# Altium project AquaSOS DevBoard.PrjPcb
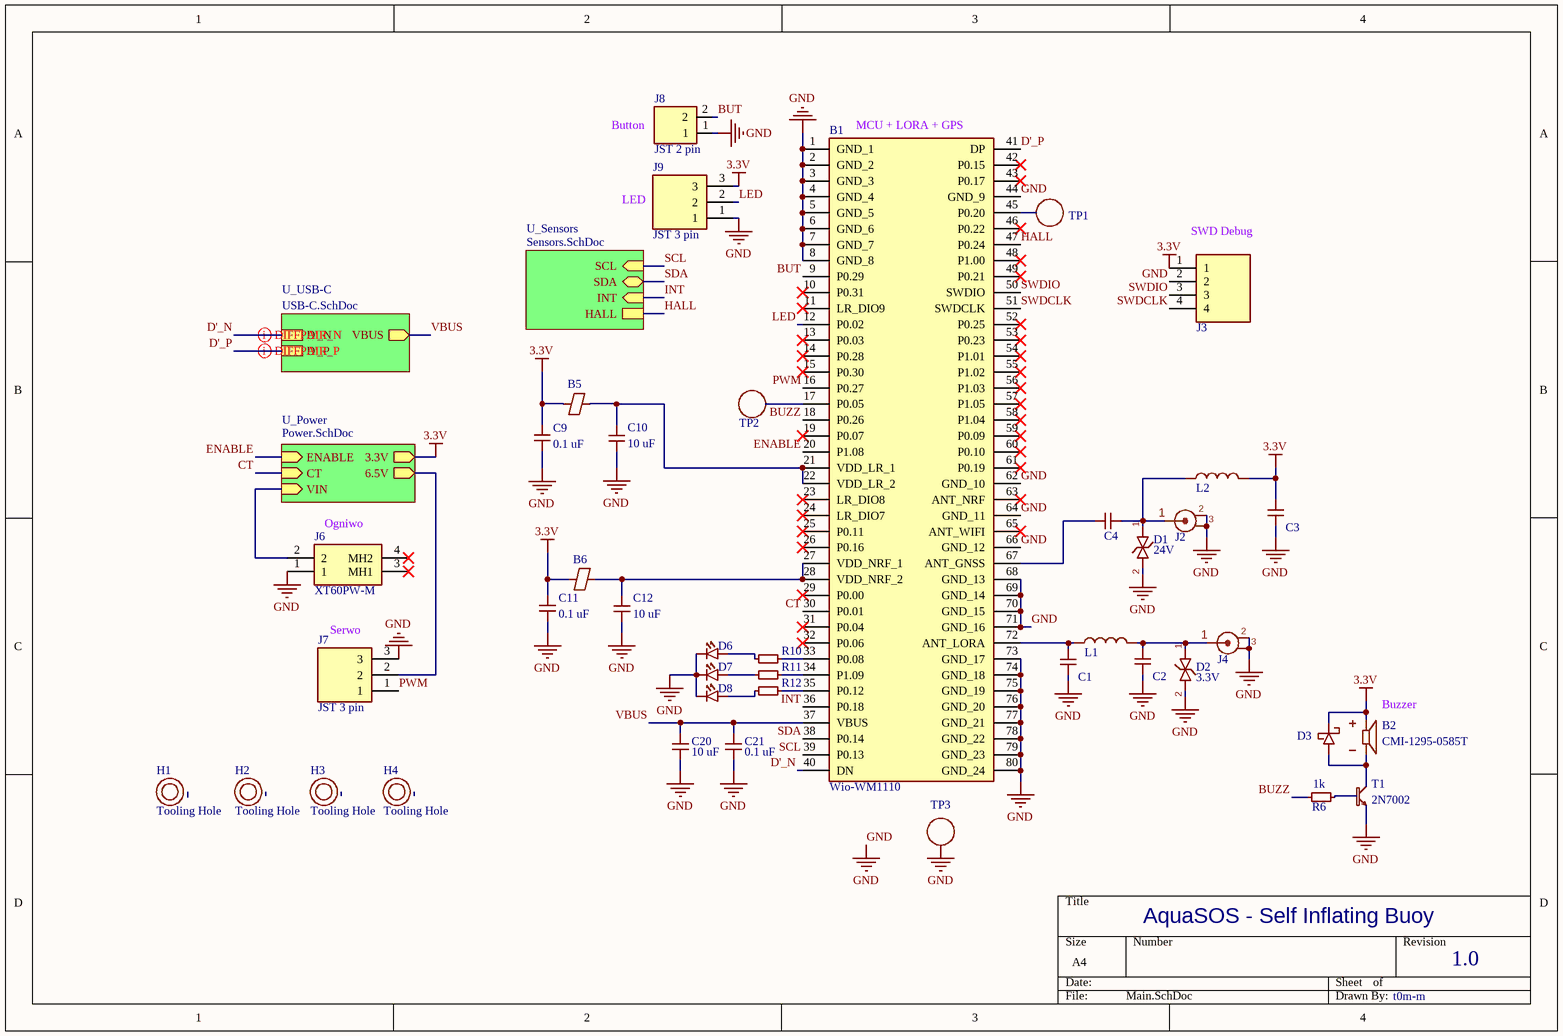
[diagram p0: Main.SchDoc]
4 sheets, 71 parts. Net scope: hierarchical (ports join the sheet entries above them; power ports are global).
Board file: PCB1.PcbDoc
Sheets:
  Main.SchDoc
    U_Sensors = Sensors.SchDoc
    U_USB-C = USB-C.SchDoc
    U_Power = Power.SchDoc

## Sheet Main.SchDoc
size A4; SheetNumber: 1; SheetTotal: 4

### Parts
B1  Wio-WM1110  [WioWM1110]
B2  CMI-1295-0585T  [CMI-1295-0585T]
B5  MPZ1608S121ATDH5  [MPZ1608S121ATDH5]  (value not drawn)
B6  MPZ1608S121ATDH5  [MPZ1608S121ATDH5]  (value not drawn)
C1  Capacitor  [KGM05CS60J106MH]  (value not drawn)
C2  Capacitor  [KGM05CS60J106MH]  (value not drawn)
C3  Capacitor  [KGM05CS60J106MH]  (value not drawn)
C4  Capacitor  [KGM05CS60J106MH]  (value not drawn)
C9  0.1 uF  [MLASU105SB7104KFNB25]
C10  10 uF  [KGM05CS60J106MH]
C11  0.1 uF  [MLASU105SB7104KFNB25]
C12  10 uF  [KGM05CS60J106MH]
C20  10 uF  [KGM05CS60J106MH]
C21  0.1 uF  [MLASU105SB7104KFNB25]
D1  24V  [RCLAMP2431TTCT]
D2  CPDV3V3A-HF  [CPDV3V3A-HF]  (value not drawn)
D3  BAT5402VH6327XTSA1  [BAT5402VH6327XTSA1]  (value not drawn)
D6  APT1608SGC  [APT1608SGC]  (value not drawn)
D7  APT1608SGC  [APT1608SGC]  (value not drawn)
D8  APT1608SGC  [APT1608SGC]  (value not drawn)
H1  Tooling Hole  [Tooling Hole]  (no BOM)
H2  Tooling Hole  [Tooling Hole]  (no BOM)
H3  Tooling Hole  [Tooling Hole]  (no BOM)
H4  Tooling Hole  [Tooling Hole]  (no BOM)
J2  U.FL-R-SMT-1(10)  [HRS_U.FL-R-SMT-1(10)]  (value not drawn)
J3  22-10-2041  [1x4 Goldpin Header]  (value not drawn)
J4  U.FL-R-SMT-1(10)  [HRS_U.FL-R-SMT-1(10)]  (value not drawn)
J6  XT60PW-M  [XT60PWM]
J7  JST 3 pin  [S3B-PH-K-S]
J8  JST 2 pin  [JST_S2B-PH-K-S(LF)(SN)]
J9  JST 3 pin  [S3B-PH-K-S]
L1  Inductor  [KGM05CS60J106MH]  (value not drawn)
L2  Inductor  [KGM05CS60J106MH]  (value not drawn)
R6  MR04X102 JTL  [MR04X102 JTL]  (value not drawn)
R10  300  [RC0402JR-075K1P]  (value not drawn)
R11  300  [RC0402JR-075K1P]  (value not drawn)
R12  300  [RC0402JR-075K1P]  (value not drawn)
T1  2N7002  [2N7002]
TP1  TP  [Test Point]  (value not drawn)  (no BOM)
TP2  TP  [Test Point]  (value not drawn)  (no BOM)
TP3  TP  [Test Point]  (value not drawn)  (no BOM)

### Sub-sheets
U_Power = Power.SchDoc: ENABLE (in), 6.5V (out), VIN (in), CT (in), 3.3V (out)
U_Sensors = Sensors.SchDoc: SCL (in), SDA (bidir), INT (in), HALL
U_USB-C = USB-C.SchDoc: VBUS (out), D'_N, D'_P

### Nets
3.3V: B2.P B5.1 B6.1 C3.1 C9.1 C11.1 D3.2(A) J3.1 J9.3 L2.2 ; sheet U_Power/3.3V
GND: B1.1(GND_1) B1.2(GND_2) B1.3(GND_3) B1.4(GND_4) B1.5(GND_5) B1.6(GND_6) B1.7(GND_7) B1.8(GND_8) B1.44(GND_9) B1.62(GND_10) B1.64(GND_11) B1.66(GND_12) B1.68(GND_13) B1.69(GND_14) B1.70(GND_15) B1.71(GND_16) B1.73(GND_17) B1.74(GND_18) B1.75(GND_19) B1.76(GND_20) B1.77(GND_21) B1.78(GND_22) B1.79(GND_23) B1.80(GND_24) C1.2 C2.2 C3.2 C9.2 C10.2 C11.2 C12.2 C20.2 C21.2 D1.2(A) D2.2(A) D6.1(K) D7.1(K) D8.1(K) J2.2 J2.3 J3.2 J4.2 J4.3 J6.1 J7.3 J8.1 J9.1 T1.2(S) TP3.1
6.5V: J7.2 ; sheet U_Power/6.5V
BUT: B1.9(P0.29) J8.2
BUZZ: B1.18(P0.26) R6.1
CT: B1.30(P0.01) ; sheet U_Power/CT
D'_N: B1.40(DN) ; sheet U_USB-C/D'_N
D'_P: B1.41(DP) ; sheet U_USB-C/D'_P
ENABLE: B1.20(P1.08) ; sheet U_Power/ENABLE
HALL: B1.47(P0.24) ; sheet U_Sensors/HALL
INT: B1.36(P0.18) ; sheet U_Sensors/INT
LED: B1.12(P0.02) J9.2
PWM: B1.16(P0.27) J7.1
SCL: B1.39(P0.13) ; sheet U_Sensors/SCL
SDA: B1.38(P0.14) ; sheet U_Sensors/SDA
SWDCLK: B1.51(SWDCLK) J3.4
SWDIO: B1.50(SWDIO) J3.3
VBUS: B1.37(VBUS) C20.1 C21.1 ; sheet U_USB-C/VBUS
VIN: J6.2 ; sheet U_Power/VIN
NetB1_17: B1.17(P0.05) TP2.1
NetB1_21: B1.21(VDD_LR_1) B1.22(VDD_LR_2) B5.2 C10.1
NetB1_27: B1.27(VDD_NRF_1) B1.28(VDD_NRF_2) B6.2 C12.1
NetB1_33: B1.33(P0.08) R10.2
NetB1_34: B1.34(P1.09) R11.2
NetB1_35: B1.35(P0.12) R12.2
NetB1_45: B1.45(P0.20) TP1.1
NetB1_67: B1.67(ANT_GNSS) C4.1
NetB1_72: B1.72(ANT_LORA) C1.1 L1.1
NetB2_N: B2.N D3.1(K) T1.3(D)
NetC2_1: C2.1 D2.1(K) J4.1 L1.2
NetC4_2: C4.2 D1.1(K) J2.1 L2.1
NetD6_2: D6.2(A) R10.1
NetD7_2: D7.2(A) R11.1
NetD8_2: D8.2(A) R12.1
NetR6_2: R6.2 T1.1(G)

Not connected (* = marked no-connect by the designer): B1 10(P0.31)* 11(LR_DIO9)* 13(P0.03)* 14(P0.28)* 15(P0.30)* 19(P0.07)* 23(LR_DIO8)* 24(LR_DIO7)* 25(P0.11)* 26(P0.16)* 29(P0.00)* 31(P0.04)* 32(P0.06)* 42(P0.15)* 43(P0.17)* 46(P0.22)* 48(P1.00)* 49(P0.21)* 52(P0.25)* 53(P0.23)* 54(P1.01)* 55(P1.02)* 56(P1.03)* 57(P1.05)* 58(P1.04)* 59(P0.09)* 60(P0.10)* 61(P0.19)* 63(ANT_NRF)* 65(ANT_WIFI)*; J6 3(MH1)* 4(MH2)*

### Layout directives
differential pair: D'_N, D'_P

### Notes on the sheet
- (near J8) Button
- (near B1) MCU + LORA + GPS
- LED
- (near J3) SWD Debug
- (near J6) Ogniwo
- (near J7) Serwo
- (near D2) 3.3V
- (near B2) Buzzer
- (near R6) 1k
- AquaSOS - Self Inflating Buoy
- 1.0
- t0m-m

### Library data of the parts
B1 = Wio-WM1110: LoRa Wireless Module - Powered by Semtech; Manufacturer_Name: Seeed Studio; Geometry.Height: 2.3mm; Manufacturer_Part_Number: Wio-WM1110; Mouser Part Number: *; Mouser Price/Stock: *; Arrow Part Number: *; Arrow Price/Stock: *; Datasheet Link: https://files.seeedstudio.com/products/SenseCAP/Wio-WM1110/Wio-WM1110_Module_Datasheet_V1.3.pdf; ComponentLink1Description: Shop link; ComponentLink1URL: https://botland.com.pl/lokalizatory-gps-gsm-bluetooth/23517-wio-wm1110-uklad-loragpswifibluetooth-semtech-lr1110-nordic-nrf52840-seeedstudio-114992865.html
B2 = CMI-1295-0585T: Buzzer
B5 B6 = MPZ1608S121ATDH5: Ferrite Beads 0603 120ohms 2000mA Power Line AEC-Q200; Manufacturer_Name: TDK; Geometry.Height: 0.75mm; Mouser Part Number: 810-MPZ1608S121ATDH5; Mouser Price/Stock: https://www.mouser.co.uk/ProductDetail/TDK/MPZ1608S121ATDH5?qs=pvNC7ksEVIcGR4VJPzSI2g%3D%3D; Manufacturer_Part_Number: MPZ1608S121ATDH5; Datasheet Link: https://product.tdk.com/system/files/dam/doc/product/emc/emc/beads/catalog/beads_automotive_power_mpz1608_en.pdf
C1-C4 = Capacitor: 0402 SMD
C9 C11 C21 = MLASU105SB7104KFNB25: 0.1uF Capacitor
C10 C12 C20 = KGM05CS60J106MH: 10 uF Capacitor
D1 = RCLAMP2431T.TCT: ESD Suppressors / TVS Diodes LOW CAP/ESD CLAP, 1 LINE; Manufacturer_Name: SEMTECH; Geometry.Height: 0.43mm; Mouser Part Number: 947-RCLAMP2431T.TCT; Mouser Price/Stock: https://www.mouser.co.uk/ProductDetail/Semtech/RCLAMP2431T.TCT?qs=rBWM4%252BvDhIfEdbY6IS5fCw%3D%3D; Manufacturer_Part_Number: RCLAMP2431T.TCT; Datasheet Link: https://semtech.my.salesforce.com/sfc/p/#E0000000JelG/a/44000000MChm/nAD_16Ash9zTcNc8tEIG0CGjjA0gXByRbqZlpqVEQMY
D2 = CPDV3V3A-HF: 3.3 V, 0.4pF, Bidirectional
D3 = BAT5402VH6327XTSA1: Schottky Diode
D6-D8 = APT1608SGC: 0402 SMD LED
J2 J4 = U.FL-R-SMT-1(10): Antenna Connector
J3 = 1x4 Goldpin Header: Headers & Wire Housings VERT PCB HDR 4P GOLD PLATING; Manufacturer_Name: Molex; Geometry.Height: 11.17mm; Mouser Part Number: 538-22-10-2041; Mouser Price/Stock: https://www.mouser.co.uk/ProductDetail/Molex/22-10-2041?qs=I2tGkhXPHwPlInpHG6ZNmQ%3D%3D; Manufacturer_Part_Number: 22-10-2041; Datasheet Link: https://www.molex.com/en-us/products/part-detail/22102041?display=pdf
J6 = XT60PW-M: Connector: DC supply; socket; XT60; male; PIN: 2; on PCBs; THT; 30A; Manufacturer_Name: Amass; Geometry.Height: 8.4mm; TME Electronic Components Part Number: *; TME Electronic Components Price/Stock: *; Manufacturer_Part_Number: XT60PW-M; Datasheet Link: https://www.tme.eu/Document/b13629717d44ae038681dba08d18c0b6/XT60PW-M.pdf
J7 J9 = JST 3 pin: JST 3 pin connector
J8 = JST 2 pin: Connector Header Through Hole, Right Angle 2 position; MF: JST Sales America Inc.; MP: S2B-PH-K-S(LF)(SN); SnapEDA_Link: https://www.snapeda.com/parts/S2B-PH-K-S(LF)(SN)/JST/view-part/?ref=snap; Package: NON STANDARD-2 J.S.T.; Value: *; Check_prices: https://www.snapeda.com/parts/S2B-PH-K-S(LF)(SN)/JST/view-part/?ref=eda
R6 = MR04X102 JTL: 1k 0402 Resistor
R10-R12 = CR0402-FX-3000GLF
T1 = 2N7002: Transistor
TP1-TP3 = Test Point

## Sheet Sensors.SchDoc
size A4; SheetNumber: 2; SheetTotal: 4
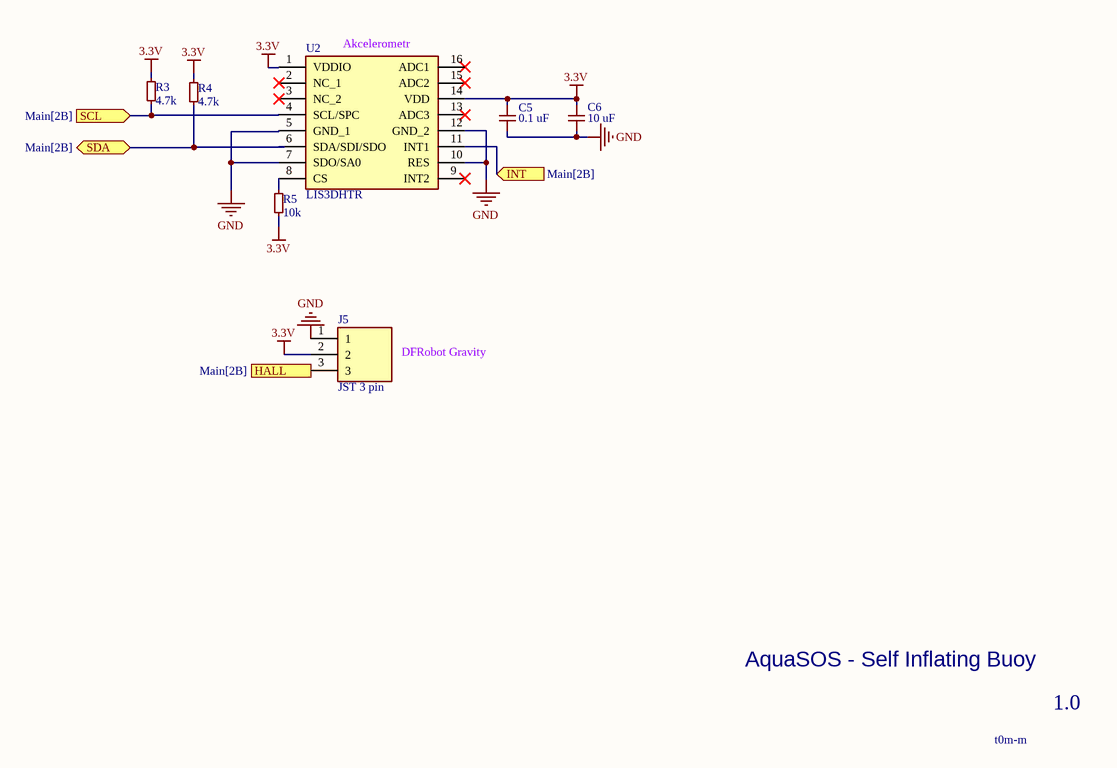
[diagram p1: Sensors.SchDoc]

### Parts
C5  0.1 uF  [MLASU105SB7104KFNB25]
C6  10 uF  [KGM05CS60J106MH]
J5  JST 3 pin  [S3B-PH-K-S]
R3  4.7k  [CRCW040210K0FKEDC]
R4  4.7k  [CRCW040210K0FKEDC]
R5  10k  [CRCW040210K0FKEDC]
U2  LIS3DHTR  [LIS3DHTR]

### Ports
HALL (see Main[2B]), INT (in, see Main[2B]), SCL (in, see Main[2B]), SDA (bidir, see Main[2B])

### Nets
3.3V: C5.1 C6.1 J5.2 R3.1 R4.2 R5.2 U2.1(VDDIO) U2.14(VDD)
GND: C5.2 C6.2 J5.1 U2.5(GND_1) U2.7(SDO/SA0) U2.10(RES) U2.12(GND_2)
HALL: J5.3 ; port HALL
INT: U2.11(INT1) ; port INT
SCL: R3.2 U2.4(SCL/SPC) ; port SCL
SDA: R4.1 U2.6(SDA/SDI/SDO) ; port SDA
NetR5_1: R5.1 U2.8(CS)

Not connected (* = marked no-connect by the designer): U2 2(NC_1)* 3(NC_2)* 9(INT2)* 13(ADC3)* 15(ADC2)* 16(ADC1)*

### Notes on the sheet
- (near U2) Akcelerometr
- DFRobot Gravity
- AquaSOS - Self Inflating Buoy
- 1.0
- t0m-m

### Library data of the parts
C5 = MLASU105SB7104KFNB25: 0.1uF Capacitor
C6 = KGM05CS60J106MH: 10 uF Capacitor
J5 = JST 3 pin: JST 3 pin connector
R3 R4 = RC0402FR-7D4K7L: 4.7k 0402 resistor
R5 = CRCW040210K0FKEDC: 10k 0402 Resistor
U2 = LIS3DHTR: Accelerometer 3-Axis 2g/16g 1.8V LGA16 STMicroelectronics LIS3DHTR Accelerometer IC, 3-axis, I2C, SPI 1.71  3.6 V, 16-Pin LGA; Geometry.Height: 1mm; Mouser Part Number: 511-LIS3DHTR; Mouser Price/Stock: https://www.mouser.co.uk/ProductDetail/STMicroelectronics/LIS3DHTR?qs=6la6oa3D8xzhXYax3cEo4w%3D%3D; Manufacturer_Name: STMicroelectronics; Manufacturer_Part_Number: LIS3DHTR; Datasheet Link: https://www.st.com/resource/en/datasheet/lis3dh.pdf

## Sheet USB-C.SchDoc
size A4; SheetNumber: 3; SheetTotal: 4
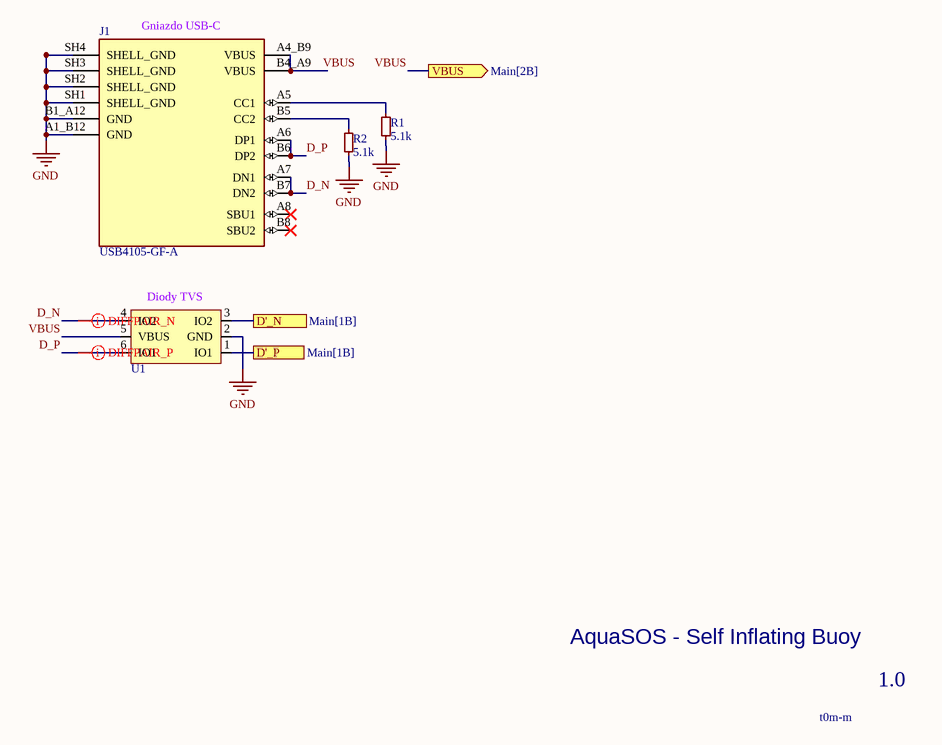
[diagram p2: USB-C.SchDoc]

### Parts
J1  USB4105-GF-A  [GCT_USB4105-GF-A]
R1  5.1k  [RC0402JR-075K1P]
R2  5.1k  [RC0402JR-075K1P]
U1  USBLC6-2SC6  [USBLC6-2SC6]  (value not drawn)

### Ports
D'_N (see Main[1B]), D'_P (see Main[1B]), VBUS (out, see Main[2B])

### Nets
GND: J1.A1_B12(GND) J1.B1_A12(GND) J1.SH1(SHELL_GND) J1.SH2(SHELL_GND) J1.SH3(SHELL_GND) J1.SH4(SHELL_GND) R1.2 R2.2 U1.2(GND)
D'_N: U1.3(IO2) ; port D'_N
D'_P: U1.1(IO1) ; port D'_P
D_N: J1.A7(DN1) J1.B7(DN2) U1.4(IO2)
D_P: J1.A6(DP1) J1.B6(DP2) U1.6(IO1)
VBUS: J1.A4_B9(VBUS) J1.B4_A9(VBUS) U1.5(VBUS) ; port VBUS
NetJ1_A5: J1.A5(CC1) R1.1
NetJ1_B5: J1.B5(CC2) R2.1

Not connected (* = marked no-connect by the designer): J1 A8(SBU1)* B8(SBU2)*

### Layout directives
differential pair: D_N, D_P

### Notes on the sheet
- (near J1) Gniazdo USB-C
- (near U1) Diody TVS
- AquaSOS - Self Inflating Buoy
- 1.0
- t0m-m

### Library data of the parts
J1 = USB4105-GF-A: USB-C Connector, USB 2.0; MF: {'manufacturer': u'GCT'}; Package: None; Price: None; Value: *; MP: USB4105-GF-A; Availability: Unavailable
R1 R2 = RC0402JR-075K1P: 5.1k resistor; ComponentLink1Description: Mouser link; ComponentLink1URL: https://www.mouser.pl/ProductDetail/YAGEO/RC0402JR-075K1P?qs=qpJ%252B%252B%252Bdg6p1LG47uFSJoBw%3D%3D
U1 = USBLC6-2SC6: ESD/TVS Diodes; ComponentLink1Description: Mouser Link; ComponentLink1URL: https://www.mouser.pl/ProductDetail/STMicroelectronics/USBLC6-2SC6?qs=po45yt2pPpu%2FhNIlwQdTlg%3D%3D&utm_id=9882661914&utm_source=google&utm_medium=cpc&utm_marketing_tactic=emeacorp&gad_source=1&gad_campaignid=9882661914&gbraid=0AAAAADn_wf3e2b9L6UzwCvd5llWdJDX32&gclid=CjwKCAiAtLvMBhB_EiwA1u6_PphI6vqALNJyH9qzLX2TgkqKXihyqulPr-2MUC0dCpD_RqMgLp4OABoC-lQQAvD_BwE

## Sheet Power.SchDoc
size A4; SheetNumber: 4; SheetTotal: 4
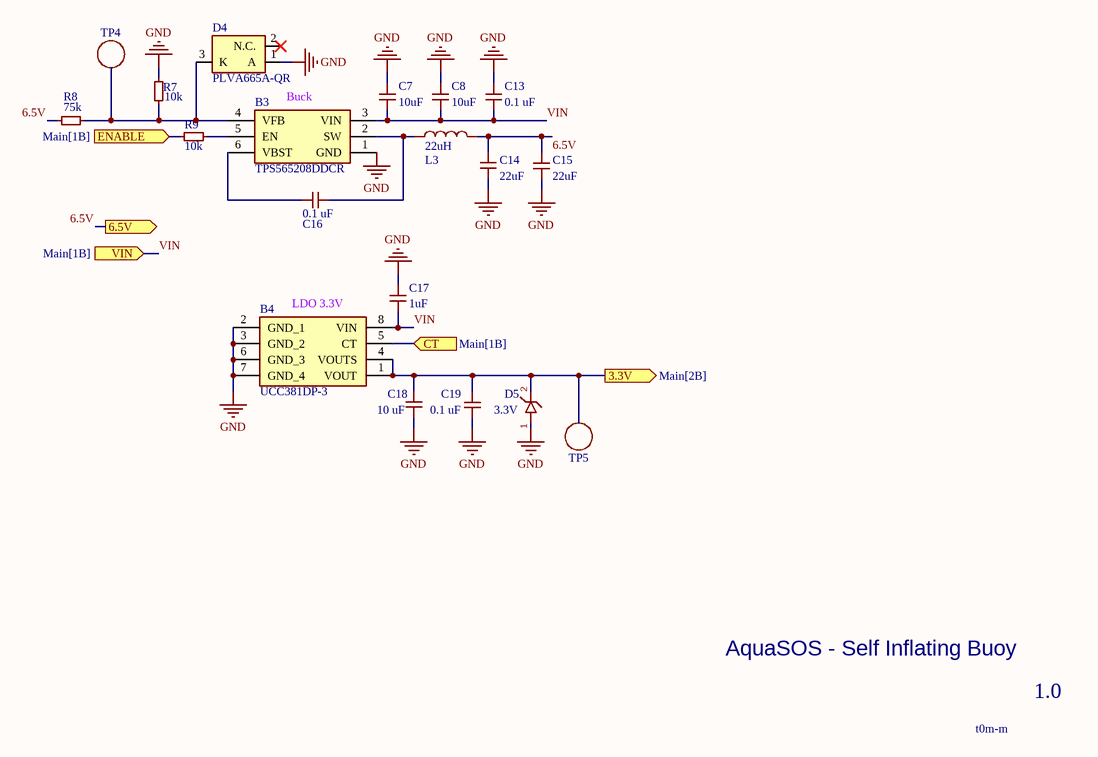
[diagram p3: Power.SchDoc]

### Parts
B3  TPS565208DDCR  [SOT95P280X110-6N]
B4  UCC381DP-3  [UCC381DP-3-8N]
C7  10uF  [CAPC2012X145N]
C8  10uF  [CAPC2012X145N]
C13  0.1 uF  [MLASU105SB7104KFNB25]
C14  22uF  [CL31X226KPHN3NE]
C15  22uF  [CL31X226KPHN3NE]
C16  0.1 uF  [MLASU105SB7104KFNB25]
C17  1uF  [MLASU105SB7104KFNB25]
C18  10 uF  [KGM05CS60J106MH]
C19  0.1 uF  [MLASU105SB7104KFNB25]
D4  PLVA665A-QR  [PLVA665A-QR]
D5  3.3V  [MMSZ5226C-HE3_A-08]
L3  22uH  [SRR1240-3R3Y]
R7  10k  [CRCW040210K0FKEDC]
R8  75k  [CRCW040210K0FKEDC]
R9  10k  [CRCW040210K0FKEDC]
TP4  TP  [Test Point]  (value not drawn)  (no BOM)
TP5  TP  [Test Point]  (value not drawn)  (no BOM)

### Ports
3.3V (out, see Main[2B]), 6.5V (out, see Main[2B]), CT (in, see Main[1B]), ENABLE (in, see Main[1B]), VIN (in, see Main[1B])

### Nets
3.3V: B4.1(VOUT) B4.4(VOUTS) C18.1 C19.1 D5.2(A) TP5.1 ; port 3.3V
GND: B3.1(GND) B4.2(GND_1) B4.3(GND_2) B4.6(GND_3) B4.7(GND_4) C7.2 C8.2 C13.1 C14.2 C15.2 C17.1 C18.2 C19.2 D4.1(A) D5.1(K) R7.1
6.5V: C14.1 C15.1 L3.2 R8.1 ; port 6.5V
CT: B4.5(CT) ; port CT
ENABLE: R9.1 ; port ENABLE
VIN: B3.3(VIN) B4.8(VIN) C7.1 C8.1 C13.2 C17.2 ; port VIN
NetB3_2: B3.2(SW) C16.2 L3.1
NetB3_4: B3.4(VFB) D4.3(K) R7.2 R8.2 TP4.1
NetB3_5: B3.5(EN) R9.2
NetB3_6: B3.6(VBST) C16.1

Not connected (* = marked no-connect by the designer): D4 2(N.C.)*

### Notes on the sheet
- (near B3) Buck
- (near B4) LDO 3.3V
- AquaSOS - Self Inflating Buoy
- 1.0
- t0m-m

### Library data of the parts
B3 = TPS565208DDCR: 4.5V to 17V, 5A Synchronous Step-Down Voltage Regulator in SOT23; Manufacturer_Name: Texas Instruments; Geometry.Height: 1.1mm; Mouser Part Number: 595-TPS565208DDCR; Mouser Price/Stock: https://www.mouser.co.uk/ProductDetail/Texas-Instruments/TPS565208DDCR?qs=YCa%2FAAYMW00vylGjeU1iOg%3D%3D; Manufacturer_Part_Number: TPS565208DDCR; Datasheet Link: http://www.ti.com/lit/gpn/tps565208
B4 = UCC381DP-3: 1-A, Low-Dropout Linear Regulator; Manufacturer_Name: Texas Instruments; Geometry.Height: 1.75mm; Mouser Part Number: 595-UCC381DP-3; Mouser Price/Stock: https://www.mouser.co.uk/ProductDetail/Texas-Instruments/UCC381DP-3?qs=zqbRmZ%252BfZD%2FJDJYUm2bEUA%3D%3D; Manufacturer_Part_Number: UCC381DP-3; Datasheet Link: http://www.ti.com/lit/gpn/ucc381
C7 C8 = C0805X106K8RACAUTO7210
C13 C16 C19 = MLASU105SB7104KFNB25: 0.1uF Capacitor
C14 C15 = CL31X226KPHN3NE: CAP CER 22UF 10V X6S 1206
C17 = GRM155Z71A105KE01D: 1uF 0402 10V
C18 = KGM05CS60J106MH: 10 uF Capacitor
D4 = PLVA665A-QR: Zener Diode 6.5 V 250 mW +/-3.08% Surface Mount TO-236AB; Manufacturer_Name: Nexperia; Geometry.Height: 1.1mm; Mouser Part Number: 771-PLVA665A-QR; Mouser Price/Stock: https://www.mouser.co.uk/ProductDetail/Nexperia/PLVA665A-QR?qs=Wj%2FVkw3K%252BMC5ajF4QI9XNg%3D%3D; Manufacturer_Part_Number: PLVA665A-QR; Datasheet Link: https://assets.nexperia.com/documents/data-sheet/PLVA6XXA-Q_SER.pdf
D5 = MMSZ5226C-HE3_A-08: 3.3V Zener Diode
L3 = SRR1240-3R3Y
R7 R9 = CRCW040210K0FKEDC: 10k 0402 Resistor
R8 = RT73F1E75KBTH
TP4 TP5 = Test Point

## Nets that join several sheets
3.3V: Main (10 pins), Sensors (8 pins), Power (6 pins)
GND: Main (49 pins), Sensors (7 pins), USB-C (9 pins), Power (16 pins)
6.5V: Main (J7.2), Power (C14.1 C15.1 L3.2 R8.1)
CT: Main (B1.30), Power (B4.5)
D'_N: Main (B1.40), USB-C (U1.3)
D'_P: Main (B1.41), USB-C (U1.1)
ENABLE: Main (B1.20), Power (R9.1)
HALL: Main (B1.47), Sensors (J5.3)
INT: Main (B1.36), Sensors (U2.11)
SCL: Main (B1.39), Sensors (R3.2 U2.4)
SDA: Main (B1.38), Sensors (R4.1 U2.6)
VBUS: Main (B1.37 C20.1 C21.1), USB-C (J1.A4_B9 J1.B4_A9 U1.5)
VIN: Main (J6.2), Power (6 pins)